# Altium schematic sheet EEG_Thesis.SchDoc
size 805 x 279 mm; SheetNumber: 1; SheetTotal: 1
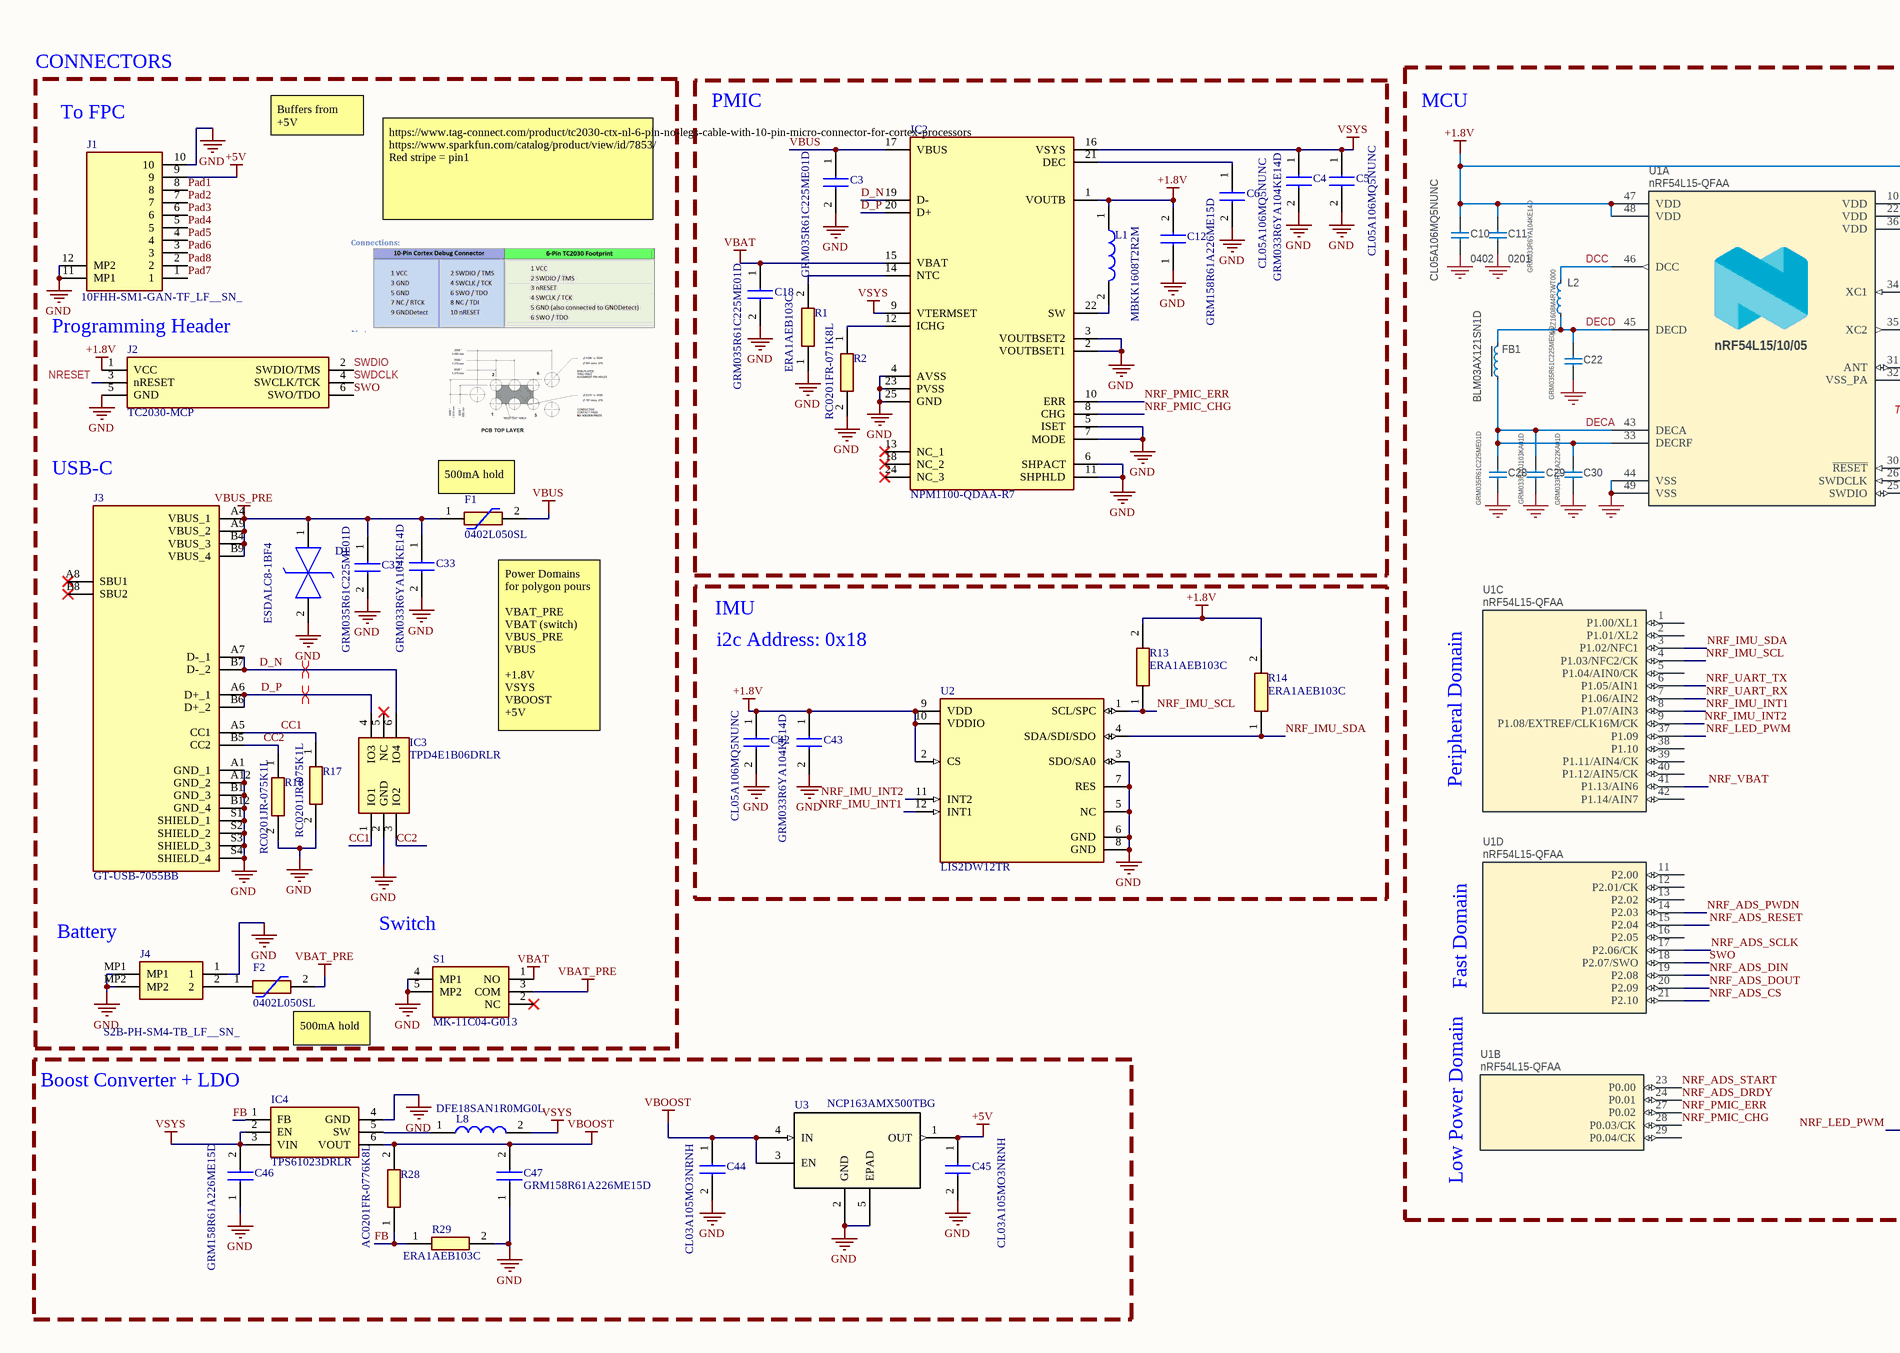
[diagram p0: EEG_Thesis.SchDoc, left]
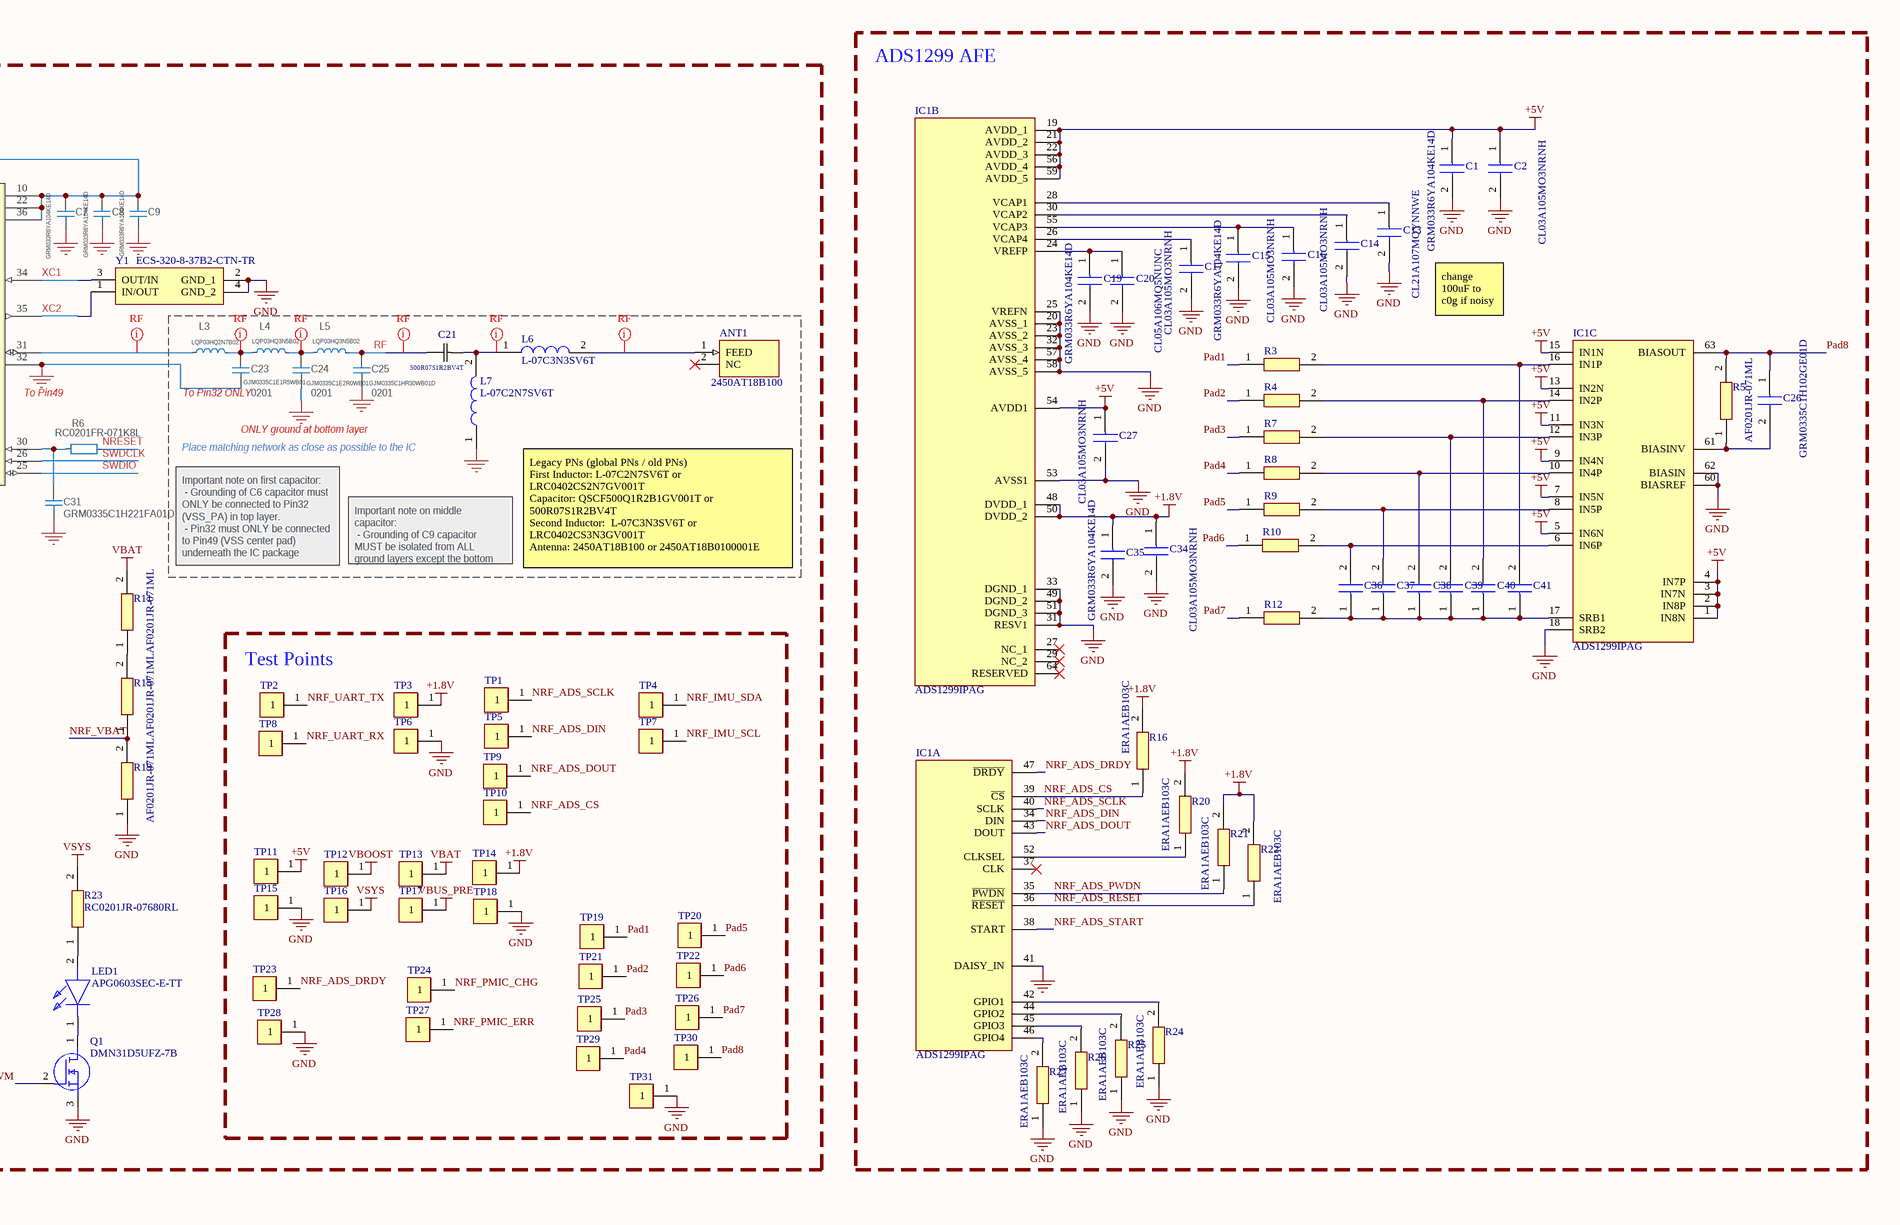
[diagram p1: EEG_Thesis.SchDoc, right]

## Parts
ANT1  2450AT18B100  [ANTC3216X140N]
C1  GRM033R6YA104KE14D  [CAPC0603X33N]
C2  CL03A105MO3NRNH  [CAPC0603X39N]
C3  GRM035R61C225ME01D  [GRM033D70J224ME01D]
C4  GRM033R6YA104KE14D  [CAPC0603X33N]
C5  CL05A106MQ5NUNC  [CAPC1005X70N]
C6  CL05A106MQ5NUNC  [CAPC1005X70N]
C7  GRM033R6YA104KE14D  [0201_GENERIC_CAP]
C8  GRM033R6YA104KE14D  [0201_GENERIC_CAP]
C9  GRM033R6YA104KE14D  [0201_GENERIC_CAP]
C10  CL05A106MQ5NUNC  Footprint Doc: 0402  [0402_Generic_CAP]
C11  GRM033R6YA104KE14D  Footprint Doc: 0201  [0201_GENERIC_CAP]
C12  GRM158R61A226ME15D  [GRM15x]
C13  CL21A107MQYNNWE  [CAPC2012X145N]
C14  CL03A105MO3NRNH  [CAPC0603X39N]
C15  GRM033R6YA104KE14D  [CAPC0603X33N]
C16  CL03A105MO3NRNH  [CAPC0603X39N]
C17  CL03A105MO3NRNH  [CAPC0603X39N]
C18  GRM035R61C225ME01D  [GRM033D70J224ME01D]
C19  GRM033R6YA104KE14D  [CAPC0603X33N]
C20  CL05A106MQ5NUNC  [CAPC1005X70N]
C21  500R07S1R2BV4T  [CAP_500R07S1R2BV4T_JOT]
C22  GRM035R61C225ME01D  [0201_GENERIC_CAP]
C23  GJM0335C1E1R5WB01  Footprint Doc: 0201  [0201_GENERIC_CAP]
C24  GJM0335C1E2R0WB01  Footprint Doc: 0201  [0201_GENERIC_CAP]
C25  GJM0335C1HR30WB01D  Footprint Doc: 0201  [0201_GENERIC_CAP]
C26  GRM0335C1H102GE01D  [GRM033D70J224ME01D]
C27  CL03A105MO3NRNH  [CAPC0603X39N]
C28  GRM035R61C225ME01D  [0201_GENERIC_CAP]
C29  GRM033R70J103KA01D  [0201_GENERIC_CAP]
C30  GRM033R71A222KA01D  [0201_GENERIC_CAP]
C31  GRM0335C1H221FA01D  [0201_GENERIC_CAP]
C32  GRM035R61C225ME01D  [GRM033D70J224ME01D]
C33  GRM033R6YA104KE14D  [CAPC0603X33N]
C34  CL03A105MO3NRNH  [CAPC0603X39N]
C35  GRM033R6YA104KE14D  [CAPC0603X33N]
C36  GRM0335C1H221FA01D  [GRM033D70J224ME01D]  (value not drawn)
C37  GRM0335C1H221FA01D  [GRM033D70J224ME01D]  (value not drawn)
C38  GRM0335C1H221FA01D  [GRM033D70J224ME01D]  (value not drawn)
C39  GRM0335C1H221FA01D  [GRM033D70J224ME01D]  (value not drawn)
C40  GRM0335C1H221FA01D  [GRM033D70J224ME01D]  (value not drawn)
C41  GRM0335C1H221FA01D  [GRM033D70J224ME01D]  (value not drawn)
C42  CL05A106MQ5NUNC  [CAPC1005X70N]
C43  GRM033R6YA104KE14D  [CAPC0603X33N]
C44  CL03A105MO3NRNH  [CAPC0603X39N]
C45  CL03A105MO3NRNH  [CAPC0603X39N]
C46  GRM158R61A226ME15D  [GRM15x]
C47  GRM158R61A226ME15D  [GRM15x]
D1  ESDALC8-1BF4  [ESDALC81BF4]
F1  0402L050SL  [0402L010SLKR]
F2  0402L050SL  [0402L010SLKR]
FB1  BLM03AX121SN1D  [BLM03AX121SN1D]
IC1  ADS1299IPAG  [QFP50P1200X1200X120-64N]  (parts A,B,C of 3)
IC2  NPM1100-QDAA-R7  [QFN50P400X400X90-25N-D]
IC3  TPD4E1B06DRLR  [SOTFL50P160X60-6N]
IC4  TPS61023DRLR  [SOTFL50P160X60-6N]
J1  10FHH-SM1-GAN-TF_LF__SN_  [10FHHSM1GANTFLFSN]
J2  TC2030-MCP  [TC2030MCP]
J3  GT-USB-7055BB  [GTUSB7055BB]
J4  S2B-PH-SM4-TB_LF__SN_  [S2BPHSM4TBLFSN]
L1  MBKK1608T2R2M  [MBKK1608T1R0M]
L2  MLZ1608M4R7WT000  [MLZ1608M4R7WT000]
L3  LQP03HQ2N7B02  [LQP03HQ2N7B02]
L4  LQP03HQ3N5B02  [LQP03HQ2N7B02]
L5  LQP03HQ3N5B02  [LQP03HQ2N7B02]
L6  L-07C3N3SV6T  [INDC1005X60N]
L7  L-07C2N7SV6T  [INDC1005X60N]
L8  DFE18SAN1R0MG0L  [INDC1608X100N]
LED1  APG0603SEC-E-TT  [APG0603SECETT]
Q1  DMN31D5UFZ-7B  [X2-DFN0606-3]
R1  ERA1AEB103C  [ERA1A_(0201)]
R2  RC0201FR-071K8L  [RESC0603X26N]
R3  ERA1AEB103C  [ERA1A_(0201)]  (value not drawn)
R4  ERA1AEB103C  [ERA1A_(0201)]  (value not drawn)
R5  AF0201JR-071ML  [ERA1A_(0201)]
R6  RC0201FR-071K8L  [0201_GENERIC_RES]
R7  ERA1AEB103C  [ERA1A_(0201)]  (value not drawn)
R8  ERA1AEB103C  [ERA1A_(0201)]  (value not drawn)
R9  ERA1AEB103C  [ERA1A_(0201)]  (value not drawn)
R10  ERA1AEB103C  [ERA1A_(0201)]  (value not drawn)
R11  AF0201JR-071ML  [ERA1A_(0201)]
R12  ERA1AEB103C  [ERA1A_(0201)]  (value not drawn)
R13  ERA1AEB103C  [ERA1A_(0201)]
R14  ERA1AEB103C  [ERA1A_(0201)]
R15  AF0201JR-071ML  [ERA1A_(0201)]
R16  ERA1AEB103C  [ERA1A_(0201)]
R17  RC0201JR-075K1L  [RESC0603X26N]
R18  RC0201JR-075K1L  [RESC0603X26N]
R19  AF0201JR-071ML  [ERA1A_(0201)]
R20  ERA1AEB103C  [ERA1A_(0201)]
R21  ERA1AEB103C  [ERA1A_(0201)]
R22  ERA1AEB103C  [ERA1A_(0201)]
R23  RC0201JR-07680RL  [RESC0603X26N]
R24  ERA1AEB103C  [ERA1A_(0201)]
R25  ERA1AEB103C  [ERA1A_(0201)]
R26  ERA1AEB103C  [ERA1A_(0201)]
R27  ERA1AEB103C  [ERA1A_(0201)]
R28  AC0201FR-0776K8L  [RESC0603X26N]
R29  ERA1AEB103C  [ERA1A_(0201)]
S1  MK-11C04-G013  [MK11C04G013]
TP1  TP  [TP]  (value not drawn)
TP2  TP  [TP]  (value not drawn)
TP3  TP  [TP]  (value not drawn)
TP4  TP  [TP]  (value not drawn)
TP5  TP  [TP]  (value not drawn)
TP6  TP  [TP]  (value not drawn)
TP7  TP  [TP]  (value not drawn)
TP8  TP  [TP]  (value not drawn)
TP9  TP  [TP]  (value not drawn)
TP10  TP  [TP]  (value not drawn)
TP11  TP  [TP]  (value not drawn)
TP12  TP  [TP]  (value not drawn)
TP13  TP  [TP]  (value not drawn)
TP14  TP  [TP]  (value not drawn)
TP15  TP  [TP]  (value not drawn)
TP16  TP  [TP]  (value not drawn)
TP17  TP  [TP]  (value not drawn)
TP18  TP  [TP]  (value not drawn)
TP19  TP  [TP]  (value not drawn)
TP20  TP  [TP]  (value not drawn)
TP21  TP  [TP]  (value not drawn)
TP22  TP  [TP]  (value not drawn)
TP23  TP  [TP]  (value not drawn)
TP24  TP  [TP]  (value not drawn)
TP25  TP  [TP]  (value not drawn)
TP26  TP  [TP]  (value not drawn)
TP27  TP  [TP]  (value not drawn)
TP28  TP  [TP]  (value not drawn)
TP29  TP  [TP]  (value not drawn)
TP30  TP  [TP]  (value not drawn)
TP31  TP  [TP]  (value not drawn)
U1  nRF54L15-QFAA  [nRF54L15 CUSTOM]  (parts A,B,C,D of 4)
U2  LIS2DW12TR  [FP-LGA12-DM00170568-MFG]
U3  NCP163AMX500TBG  [XDFN4_711AJ_ONS]
Y1  ECS-320-8-37B2-CTN-TR  [ECS320837B2CTNTR]

## Blocks framed on the sheet
ADS1299 AFE: C1 C2 C13-C17 C19 C20 C26 C27 C34-C41 IC1 R3-R5 R7-R10 R12 R16 R20-R22 R24-R27
PMIC: C3-C6 C12 C18 IC2 L1 R1 R2
Test Points: TP1-TP31
Boost Converter + LDO: C44-C47 IC4 L8 R28 R29 U3

## Nets
+1.8V: C7.1 C8.1 C9.1 C10.2 C11.1 C12.2 C34.1 C35.1 C42.1 C43.1 IC1.48(DVDD_1) IC1.50(DVDD_2) IC2.1(VOUTB) J2.1(VCC) L1.1 R13.2 R14.2 R16.2 R20.2 R21.2 R22.2 TP3.1 TP14.1 U1.10(VDD) U1.22(VDD) U1.36(VDD) U1.47(VDD) U1.48(VDD) U2.2(CS) U2.9(VDD) U2.10(VDDIO)
+5V: C1.1 C2.1 C27.1 C45.1 IC1.1(IN8N) IC1.2(IN8P) IC1.3(IN7N) IC1.4(IN7P) IC1.5(IN6N) IC1.7(IN5N) IC1.9(IN4N) IC1.11(IN3N) IC1.13(IN2N) IC1.15(IN1N) IC1.19(AVDD_1) IC1.21(AVDD_2) IC1.22(AVDD_3) IC1.54(AVDD1) IC1.56(AVDD_4) IC1.59(AVDD_5) J1.9 TP11.1 U3.1(OUT)
GND: C1.2 C2.2 C3.2 C4.2 C5.2 C6.2 C7.2 C8.2 C9.2 C10.1 C11.2 C12.1 C13.2 C14.2 C15.2 C16.2 C17.2 C18.2 C19.2 C20.2 C22.1 C23.1 C24.1 C25.1 C27.2 C28.1 C29.1 C30.1 C31.1 C32.2 C33.2 C34.2 C35.2 C42.2 C43.2 C44.2 C45.2 C46.1 C47.1 D1.2(K2) IC1.18(SRB2) IC1.20(AVSS_1) IC1.23(AVSS_2) IC1.25(VREFN) IC1.31(RESV1) IC1.32(AVSS_3) IC1.33(DGND_1) IC1.41(DAISY_IN) IC1.49(DGND_2) IC1.51(DGND_3) IC1.53(AVSS1) IC1.57(AVSS_4) IC1.58(AVSS_5) IC1.60(BIASREF) IC1.62(BIASIN) IC2.2(VOUTBSET1) IC2.3(VOUTBSET2) IC2.4(AVSS) IC2.5(ISET) IC2.6(SHPACT) IC2.7(MODE) IC2.11(SHPHLD) IC2.23(PVSS) IC2.25(GND) IC3.2(GND) IC4.4(GND) J1.10 J1.11(MP1) J1.12(MP2) J2.5(GND) J3.A1(GND_1) J3.A12(GND_2) J3.B1(GND_3) J3.B12(GND_4) J3.S1(SHIELD_1) J3.S2(SHIELD_2) J3.S3(SHIELD_3) J3.S4(SHIELD_4) J4.1 J4.MP1 J4.MP2 L7.1 Q1.3(S) R1.1 R2.2 R17.2 R18.2 R19.1 R24.1 R25.1 R26.1 R27.1 R29.2 S1.4(MP1) S1.5(MP2) TP6.1 TP15.1 TP18.1 TP28.1 TP31.1 U1.32(VSS_PA) U1.44(VSS) U1.49(VSS) U2.3(SDO/SA0) U2.5(NC) U2.6(GND) U2.7(RES) U2.8(GND) U3.2(GND) U3.5(EPAD) Y1.2(GND_1) Y1.4(GND_2)
VBAT: C18.1 IC2.15(VBAT) R11.2 S1.1(NO) TP13.1
VBAT_PRE: F2.2 S1.3(COM)
VBOOST: C44.1 C47.2 IC4.6(VOUT) R28.2 TP12.1 U3.3(EN) U3.4(IN)
VBUS: C3.1 F1.2 IC2.17(VBUS)
VBUS_PRE: C32.1 C33.1 D1.1(K1) F1.1 J3.A4(VBUS_1) J3.A9(VBUS_2) J3.B4(VBUS_3) J3.B9(VBUS_4) TP17.1
VSYS: C4.1 C5.1 C46.2 IC2.9(VTERMSET) IC2.16(VSYS) IC4.2(EN) IC4.3(VIN) L8.2 R23.2 TP16.1
CC1: IC3.1(IO1) J3.A5(CC1) R17.1
CC2: IC3.3(IO2) J3.B5(CC2) R18.1
D_N: IC2.19(D-) IC3.6(IO4) J3.A7(D-_1) J3.B7(D-_2)
D_P: IC2.20(D+) IC3.4(IO3) J3.A6(D+_1) J3.B6(D+_2)
DCC: L2.1 U1.46(DCC)
DECA: C28.2 C29.2 C30.2 FB1.2 U1.33(DECRF) U1.43(DECA)
DECD: C22.2 FB1.1 L2.2 U1.45(DECD)
FB: IC4.1(FB) R28.1 R29.1
NRESET: J2.3(nRESET) R6.2
NRF_ADS_CS: IC1.39(~{CS}) R16.1 TP10.1 U1.21(P2.10)
NRF_ADS_DIN: IC1.34(DIN) TP5.1 U1.19(P2.08)
NRF_ADS_DOUT: IC1.43(DOUT) TP9.1 U1.20(P2.09)
NRF_ADS_DRDY: IC1.47(~{DRDY}) TP23.1 U1.24(P0.01)
NRF_ADS_PWDN: IC1.35(~{PWDN}) R21.1 U1.14(P2.03)
NRF_ADS_RESET: IC1.36(~{RESET}) R22.1 U1.15(P2.04)
NRF_ADS_SCLK: IC1.40(SCLK) TP1.1 U1.17(P2.06/CK)
NRF_ADS_START: IC1.38(START) U1.23(P0.00)
NRF_IMU_INT1: U1.8(P1.07/AIN3) U2.12(INT1)
NRF_IMU_INT2: U1.9(P1.08/EXTREF/CLK16M/CK) U2.11(INT2)
NRF_IMU_SCL: R13.1 TP7.1 U1.4(P1.03/NFC2/CK) U2.1(SCL/SPC)
NRF_IMU_SDA: R14.1 TP4.1 U1.3(P1.02/NFC1) U2.4(SDA/SDI/SDO)
NRF_LED_PWM: Q1.2(G) U1.37(P1.09)
NRF_PMIC_CHG: IC2.8(CHG) TP24.1 U1.28(P0.03/CK)
NRF_PMIC_ERR: IC2.10(ERR) TP27.1 U1.27(P0.02)
NRF_UART_RX: TP8.1 U1.7(P1.06/AIN2)
NRF_UART_TX: TP2.1 U1.6(P1.05/AIN1)
NRF_VBAT: R15.1 R19.2 U1.41(P1.13/AIN6)
Pad1: J1.8 R3.1 TP19.1
Pad2: J1.7 R4.1 TP21.1
Pad3: J1.6 R7.1 TP25.1
Pad4: J1.5 R8.1 TP29.1
Pad5: J1.4 R9.1 TP20.1
Pad6: J1.3 R10.1 TP22.1
Pad7: J1.1 R12.1 TP26.1
Pad8: C26.1 IC1.63(BIASOUT) J1.2 R5.2 TP30.1
RF: C21.2 C25.2 L5.2
SWDCLK: J2.4(SWCLK/TCK) U1.26(SWDCLK)
SWDIO: J2.2(SWDIO/TMS) U1.25(SWDIO)
SWO: J2.6(SWO/TDO) U1.18(P2.07/SWO)
XC1: U1.34(XC1) Y1.3(OUT/IN)
XC2: U1.35(XC2) Y1.1(IN/OUT)
NetANT1_1: ANT1.1(FEED) L6.2
NetC6_1: C6.1 IC2.21(DEC)
NetC13_1: C13.1 IC1.28(VCAP1)
NetC14_1: C14.1 IC1.30(VCAP2)
NetC15_1: C15.1 C16.1 IC1.55(VCAP3)
NetC17_1: C17.1 IC1.26(VCAP4)
NetC19_1: C19.1 C20.1 IC1.24(VREFP)
NetC21_1: C21.1 L6.1 L7.2
NetC23_2: C23.2 L3.2 L4.1
NetC24_2: C24.2 L4.2 L5.1
NetC26_2: C26.2 IC1.61(BIASINV) R5.1
NetC31_2: C31.2 R6.1 U1.30(~{RESET})
NetC36_1: C36.1 C37.1 C38.1 C39.1 C40.1 C41.1 IC1.17(SRB1) R12.2
NetC36_2: C36.2 IC1.6(IN6P) R10.2
NetC37_2: C37.2 IC1.8(IN5P) R9.2
NetC38_2: C38.2 IC1.10(IN4P) R8.2
NetC39_2: C39.2 IC1.12(IN3P) R7.2
NetC40_2: C40.2 IC1.14(IN2P) R4.2
NetC41_2: C41.2 IC1.16(IN1P) R3.2
NetF2_1: F2.1 J4.2
NetIC1_42: IC1.42(GPIO1) R24.2
NetIC1_44: IC1.44(GPIO2) R25.2
NetIC1_45: IC1.45(GPIO3) R26.2
NetIC1_46: IC1.46(GPIO4) R27.2
NetIC1_52: IC1.52(CLKSEL) R20.1
NetIC2_12: IC2.12(ICHG) R2.1
NetIC2_14: IC2.14(NTC) R1.2
NetIC2_22: IC2.22(SW) L1.2
NetIC4_5: IC4.5(SW) L8.1
NetL3_1: L3.1 U1.31(ANT)
NetLED1_1: LED1.1(K) Q1.1(D)
NetLED1_2: LED1.2(A) R23.1
NetR11_1: R11.1 R15.2

Not connected (* = marked no-connect by the designer): ANT1 2(NC)*; IC1 27(NC_1)* 29(NC_2)* 37(CLK)* 64(RESERVED)*; IC2 13(NC_1)* 18(NC_2)* 24(NC_3)*; IC3 5(NC)*; J3 A8(SBU1)* B8(SBU2)*; S1 2(NC)*; U1 1(P1.00/XL1) 2(P1.01/XL2) 5(P1.04/AIN0/CK) 11(P2.00) 12(P2.01/CK) 13(P2.02) 16(P2.05) 29(P0.04/CK) 38(P1.10) 39(P1.11/AIN4/CK) 40(P1.12/AIN5/CK) 42(P1.14/AIN7)

## Layout directives
differential pair; net class USB; differential pair class USB: D_N, D_P
net class RF: NetANT1_1, NetC21_1, NetC23_2, NetC24_2, NetL3_1, RF

## Notes on the sheet
- CONNECTORS
- (near J1) To FPC
- Buffers from +5V
- MCU
- https://www.tag-connect.com/product/tc2030-ctx-nl-6-pin-no-legs-cable-with-10-pin-micro-connector-for-cortex-processors https://www.sparkfun.com/catalog/product/view/id/7853/
  Red stripe = pin1
- change 100uF to c0g if noisy
- Programming Header
- (near U1) To Pin49
- (near C23) To Pin32 ONLY
- ONLY ground at bottom layer
- (near J3) USB-C
- (near F1) 500mA hold
- (near L7) Place matching network as close as possible to the IC
- IMU
- Important note on first capacitor:
  - Grounding of C6 capacitor must ONLY be connected to Pin32 (VSS_PA) in top layer.
  - Pin32 must ONLY be connected to Pin49 (VSS center pad) underneath the IC package
- Important note on middle capacitor:
  - Grounding of C9 capacitor MUST be isolated from ALL ground layers except the bottom ground layer.
- Legacy PNs (global PNs / old PNs)
  First Inductor: L-07C2N7SV6T or LRC0402CS2N7GV001T
  Capacitor: QSCF500Q1R2B1GV001T or 500R07S1R2BV4T
  Second Inductor:  L-07C3N3SV6T or LRC0402CS3N3GV001T
  Antenna: 2450AT18B100 or 2450AT18B0100001E
- i2c Address: 0x18
- (near F1) Power Domains
  for polygon pours
  VBAT_PRE
  VBAT (switch)
  VBUS_PRE
  VBUS
  +1.8V
  VSYS
  VBOOST
  +5V
- Peripheral Domain
- (near J4) Battery
- (near S1) Switch
- Fast Domain
- (near F2) 500mA hold
- Low Power Domain
- (in symbol nRF54L15-QFAAC00, part A) nRF54L15/10/05

## Library data of the parts
ANT1 = 2450AT18B0100001E: Antenna; Manufacturer_Name: JOHANSON TECHNOLOGY; Datasheet Link: https://www.johansontechnology.com/docs/3829/Antenna-2450AT18B0100001E-Rev5.0_uMmswfC.pdf; Height: 1.4mm; Manufacturer_Part_Number: 2450AT18B0100001E
C1 C4 C15 C19 C33 C35 C43 = GRM033R6YA104KE14D: Capacitor 0.1uF 0201; Manufacturer_Name: Murata Electronics; Datasheet Link: https://search.murata.co.jp/Ceramy/image/img/A01X/G101/ENG/GRM033R6YA104KE14-01A.pdf; Height: 0.33mm; Manufacturer_Part_Number: GRM033R6YA104KE14D; Mouser Part Number: 81-GRM33R6YA104KE14D; Mouser Price/Stock: https://www.mouser.co.uk/ProductDetail/Murata-Electronics/GRM033R6YA104KE14D?qs=P%2FC4Eoq9CDwTt3wOuyKhXw%3D%3D; Arrow Part Number: GRM033R6YA104KE14D; Arrow Price/Stock: https://www.arrow.com/en/products/grm033r6ya104ke14d/murata-manufacturing?utm_currency=USD&region=europe
C2 C14 C16 C17 C27 C34 C44 C45 = CL03A105MO3NRNH: Capacitor 1uF 0201; Manufacturer_Name: SAMSUNG; Datasheet Link: https://static6.arrow.com/aropdfconversion/5520c68c9128c972ec6f0cbf09912ac8e6a87451/cl03a105mo3nrnh.pdf; Height: 0.39mm; Manufacturer_Part_Number: CL03A105MO3NRNH; Mouser Part Number: 187-CL03A105MO3NRNH; Mouser Price/Stock: https://www.mouser.co.uk/ProductDetail/Samsung-Electro-Mechanics/CL03A105MO3NRNH?qs=%252B6g0mu59x7LEwOOdfYkIjw%3D%3D; Arrow Part Number: CL03A105MO3NRNH; Arrow Price/Stock: https://www.arrow.com/en/products/cl03a105mo3nrnh/samsung-electro-mechanics?region=europe
C3 C18 C32 = GRM035R61C225ME01D: Capacitor 2.2uF 0201; Manufacturer_Name: Murata Electronics; Datasheet Link: https://search.murata.co.jp/Ceramy/image/img/A01X/G101/ENG/GRM035R61C225ME01-01A.pdf; Height: 0.33mm; Manufacturer_Part_Number: GRM035R61C225ME01D; Mouser Part Number: 81-GRM035R61C225ME1D; Mouser Price/Stock: https://www.mouser.co.uk/ProductDetail/Murata-Electronics/GRM035R61C225ME01D?qs=DPoM0jnrROXTliYh3Jmu1A%3D%3D
C5 C6 C20 C42 = CL05A106MQ5NUNC: Capacitor 10uF 0402 6.3V; Manufacturer_Name: SAMSUNG; Datasheet Link: https://datasheet.datasheetarchive.com/originals/distributors/Datasheets-DGA10/2406160.pdf; Height: 0.7mm; Manufacturer_Part_Number: CL05A106MQ5NUNC; Mouser Part Number: 187-CL05A106MQ5NUNC; Mouser Price/Stock: https://www.mouser.co.uk/ProductDetail/Samsung-Electro-Mechanics/CL05A106MQ5NUNC?qs=X6jEic%2FHinDK8vVLi1zwpw%3D%3D; Arrow Part Number: CL05A106MQ5NUNC; Arrow Price/Stock: https://www.arrow.com/en/products/cl05a106mq5nunc/samsung-electro-mechanics.html?utm_currency=USD&region=europe
C7-C9 = C0201-100n-10V-X7R: Capacitor, X7R, ±10%; Manufacturer: N.A.; Part number NEMS: 100200469; Value: 100nF; Note: 10V; Pad Count: 2; Component Status: Active; Part Number: C0201-100n-10V-X7R; Manufacturer Part Number: N.A.; LatestRevisionDate: 2021-04-12; Published: 2021-04-12; Artikkelnr Noca: N.A.; Part number IPS: N.A.; ComponentLink1URL: N.A.; ComponentLink1Description: Datasheet; ComponentLink2URL: N.A.; ComponentLink2Description: Supplier link; HelpURL: N.A.; Supplier 1: N.A.; Supplier Part Number 1: N.A.; Supplier 2: N.A.; Supplier Part Number 2: N.A.; Component Class: Capacitors; Author: getr; Part number Norautron: N.A.; PartId: 100200469
C10 = C0402-10µF-6.3V-X6S: Capacitor 10uF 0402 6.3V; Manufacturer: N.A.; Part number NEMS: 100200478; Component Status: Active; Pad Count: 2; Value: 10µF; Part Number: C0402-10µF-6.3V-X6S; PartId: 100200478; Component Class: Capacitors; Author: getr; Manufacturer Part Number: N.A.; ComponentLink1URL: N.A.; ComponentLink1Description: Datasheet; ComponentLink2URL: N.A.; ComponentLink2Description: Supplier link; HelpURL: N.A.; LatestRevisionDate: 2021-06-25; Published: 2021-06-25; Note: 6.3V; Supplier 1: N.A.; Supplier Part Number 1: N.A.; Supplier 2: N.A.; Supplier Part Number 2: N.A.; Artikkelnr Noca: N.A.; Part number IPS: N.A.; Part number Norautron: N.A.
C11 = C0201-100n-10V-X7R: Capacitor, X7R, ±10% 0201; Manufacturer: N.A.; Part number NEMS: 100200469; Value: 100nF; Note: 10V; Pad Count: 2; Component Status: Active; Part Number: C0201-100n-10V-X7R; Manufacturer Part Number: N.A.; LatestRevisionDate: 2021-04-12; Published: 2021-04-12; Artikkelnr Noca: N.A.; Part number IPS: N.A.; ComponentLink1URL: N.A.; ComponentLink1Description: Datasheet; ComponentLink2URL: N.A.; ComponentLink2Description: Supplier link; HelpURL: N.A.; Supplier 1: N.A.; Supplier Part Number 1: N.A.; Supplier 2: N.A.; Supplier Part Number 2: N.A.; Component Class: Capacitors; Author: getr; Part number Norautron: N.A.; PartId: 100200469
C12 C46 C47 = GRM158R61A226ME15D: Capacitor 22uF 0402; Manufacturer_Name: Murata Electronics; Datasheet Link: https://search.murata.co.jp/Ceramy/image/img/A01X/G101/ENG/GRM158R61A226ME15-01A.pdf; Height: 0.33mm; Manufacturer_Part_Number: GRM158R61A226ME15D; Mouser Part Number: 81-GRM158R61A226ME5D; Mouser Price/Stock: https://www.mouser.co.uk/ProductDetail/Murata-Electronics/GRM158R61A226ME15D?qs=hd1VzrDQEGg0KAVI30ga2w%3D%3D; Arrow Part Number: GRM158R61A226ME15D; Arrow Price/Stock: https://www.arrow.com/en/products/grm158r61a226me15d/murata-manufacturing?utm_currency=USD&region=nac
C13 = CL21A107MQYNNWE: Capacitor 100uF; Manufacturer_Name: SAMSUNG; Datasheet Link: https://www.mouser.jp/datasheet/2/585/Samsung_7_14_2022_CL21A107MQYNNW_Specsheet-3000071.pdf; Height: 1.45mm; Manufacturer_Part_Number: CL21A107MQYNNWE; Mouser Part Number: 187-CL21A107MQYNNWE; Mouser Price/Stock: https://www.mouser.co.uk/ProductDetail/Samsung-Electro-Mechanics/CL21A107MQYNNWE?qs=81r%252BiQLm7BSNi6fWCnDBNQ%3D%3D; Arrow Part Number: CL21A107MQYNNWE; Arrow Price/Stock: https://www.arrow.com/en/products/cl21a107mqynnwe/samsung-electro-mechanics?utm_currency=USD&region=nac
C21 = 500R07S1R2BV4T: Description; Manufacturer_Name: Johanson Technology; Copyright: Copyright (C) 2025 Ultra Librarian. All rights reserved.; Manufacturer_Part_Number: 500R07S1R2BV4T
C22 C28 = C0201-2µ2-2.5V-X6T-GRM033D80E225ME47D: Capacitor, Ceramic, 2.2µF 2.5V X6T 0201,±20%; Manufacturer: Murata; Manufacturer Part Number: GRM033R61A225KE47; Part number NEMS: 100200527; Component Status: Active; Pad Count: 2; Note: 2.5V, 20%, X6T; Artikkelnr Noca: N.A.; Part Number: C0201-2µ2-2.5V-X6T-GRM033D80E225ME47D; Component Class: Capacitors; Author: stl1; ComponentLink1URL: https://www.murata.com/products/productdetail?partno=GRM033D80E225ME47%23; ComponentLink1Description: Datasheet; ComponentLink2URL: N.A.; ComponentLink2Description: Supplier link; HelpURL: N.A.; LatestRevisionDate: 2022-02-27; Published: 2022-02-27; Value: 2.2µF; Supplier 1: Mouser; Supplier Part Number 1: 81-GRM033D80E225ME7D; Supplier 2: Digi-Key; Supplier Part Number 2: 490-18653-1-ND; Part number IPS: N.A.; Part number Norautron: N.A.; PartId: 100200527
C23 = C0201-1.5p-25V-NP0-GJM0335C1E1R5WB01: Capacitor, 1.5pF, NP0, ±0.05pF, 25V, High Q; Manufacturer: Murata; Part number NEMS: 100200477; Component Status: Active; Pad Count: 2; Artikkelnr Noca: N.A.; Part Number: C0201-1.5p-25V-NP0-GJM0335C1E1R5WB01; PartId: 100200477; Component Class: Capacitors; Author: masi; Manufacturer Part Number: GJM0335C1E1R5WB01; ComponentLink1URL: https://search.murata.co.jp/Ceramy/image/img/A01X/G101/ENG/GJM0335C1E1R5WB01-01.pdf; ComponentLink1Description: Datasheet; ComponentLink2URL: N.A.; ComponentLink2Description: Supplier link; HelpURL: https://www.murata.com/products/productdetail?partno=GJM0335C1E1R5WB01%23; LatestRevisionDate: 2021-06-15; Published: 2021-06-15; Value: 1.5pF; Note: 25V; Supplier 1: Digi-Key; Supplier Part Number 1: 490-11176-2-ND; Supplier 2: Mouser; Supplier Part Number 2: 81-GJM0335C1E1R5WB1D; Part number IPS: N.A.; Part number Norautron: N.A.
C24 = C0201-2.0p-HQ-Murata: Capacitor, 2pF, NP0, ±0.05pF, 25V; Manufacturer: Murata; Part number IPS: 00000001775; Part number NEMS: 100200419; Component Status: Active; Pad Count: 2; Value: 2.0pF; Artikkelnr Noca: N.A.; Part Number: C0201-2.0p-HQ-Murata; PartId: 100200419; Component Class: Capacitors; Author: rsk; Manufacturer Part Number: GJM0335C1E2R0WB01; ComponentLink1URL: N.A.; ComponentLink1Description: Datasheet; ComponentLink2URL: N.A.; ComponentLink2Description: Supplier link; HelpURL: https://psearch.en.murata.com/capacitor/product/GJM0335C1E2R0WB01%23.html; LatestRevisionDate: 2018-10-25; Published: 2018-10-25; Note: 25V; Supplier 1: N.A.; Supplier Part Number 1: N.A.; Supplier 2: N.A.; Supplier Part Number 2: N.A.; Part number Norautron: N.A.
C25 = C0201-0.3p-50V-GRM0335C1HR30BA01: Capacitor, C0G, ±0.1pF, 50V; Manufacturer: Murata; Part number NEMS: 100200650; Component Status: Active; Pad Count: 2; Value: 0.3pF; Artikkelnr Noca: N.A.; Part Number: C0201-0.3p-50V-GRM0335C1HR30BA01; PartId: 100200650; Component Class: Capacitors; Author: masi; Manufacturer Part Number: GRM0335C1HR30BA01; ComponentLink1URL: https://www.murata.com/en-global/products/productdetail?partno=GRM0335C1HR30BA01%23; ComponentLink1Description: Datasheet; ComponentLink2URL: N.A.; ComponentLink2Description: Supplier link; HelpURL: N.A.; LatestRevisionDate: 2024-01-10; Published: 2024-01-10; Note: 50V; Supplier 1: Digi-Key; Supplier Part Number 1: 490-6135-2-ND; Supplier 2: Mouser; Supplier Part Number 2: 81-GRM0335C1HR30BA1D; Part number IPS: N.A.; Part number Norautron: N.A.
C26 = GRM0335C1H102GE01D: Capacitor 1nF; Manufacturer_Name: Murata Electronics; Datasheet Link: https://search.murata.co.jp/Ceramy/image/img/A01X/G101/ENG/GRM0335C1H102GE01-01A.pdf; Height: 0.33mm; Manufacturer_Part_Number: GRM0335C1H102GE01D; Mouser Part Number: 81-GRM0335C1H102GE1D; Mouser Price/Stock: https://www.mouser.co.uk/ProductDetail/Murata-Electronics/GRM0335C1H102GE01D?qs=DPoM0jnrROXb%252BXi%252BdiEYKA%3D%3D
C29 = C0201-10n-6.3V-X7R: Capacitor, 10nF; Manufacturer: Murata; Part number NEMS: 100200407; Component Status: Active; Pad Count: 2; Note: 6.3V; Artikkelnr Noca: N.A.; Part Number: C0201-10n-6.3V-X7R; PartId: 100200407; Component Class: Capacitors; Author: rsk; Manufacturer Part Number: GRM033R70J103KA01D; ComponentLink1URL: http://search.murata.co.jp/Ceramy/image/img/A01X/G101/ENG/GRM033R70J103KA01-01.pdf; ComponentLink1Description: Datasheet; ComponentLink2URL: N.A.; ComponentLink2Description: Supplier link; HelpURL: N.A.; LatestRevisionDate: 2020-10-13; Published: 2018-05-07; Value: 10nF; Supplier 1: Digi-Key; Supplier Part Number 1: 490-1262-1-ND; Supplier 2: N.A.; Supplier Part Number 2: N.A.; Part number IPS: N.A.; Part number Norautron: N.A.
C30 = C0201-2n2: Capacitor, X7R, ±10%, 10V 2.2nF; Manufacturer: N.A.; Part number IPS: 00000001778; Part number Norautron: 26470002; Part number NEMS: 100200060; Component Status: Active; Pad Count: 2; Part Number: C0201-2n2; PartId: 100200060; Component Class: Capacitors; Author: rsk; Manufacturer Part Number: N.A.; ComponentLink1URL: N.A.; ComponentLink1Description: Datasheet; ComponentLink2URL: N.A.; ComponentLink2Description: Supplier link; HelpURL: N.A.; LatestRevisionDate: 2014-11-13; Published: 2014-11-13; Value: 2.2nF; Note: 10V; Supplier 1: N.A.; Supplier Part Number 1: N.A.; Supplier 2: N.A.; Supplier Part Number 2: N.A.; Artikkelnr Noca: N.A.
C31 = C0201-3.9p: Chip Cap 0201; Manufacturer: N.A.; Part number NEMS: 100200024; Component Status: Active; Pad Count: 2; Value: 3.9pF; Note: Chip Cap 1%; Part Number: C0201-3.9p; PartId: 100200024; Component Class: Capacitors; Author: rsk; Manufacturer Part Number: N.A.; ComponentLink1URL: N.A.; ComponentLink1Description: Datasheet; ComponentLink2URL: N.A.; ComponentLink2Description: Supplier link; HelpURL: N.A.; LatestRevisionDate: 2014-11-13; Published: 2014-11-13; Supplier 1: N.A.; Supplier Part Number 1: N.A.; Supplier 2: N.A.; Supplier Part Number 2: N.A.; Artikkelnr Noca: N.A.; Part number IPS: N.A.; Part number Norautron: N.A.
C36-C41 = GRM0335C1H221FA01D: Capacitor 220pF; Manufacturer_Name: Murata Electronics; Datasheet Link: https://search.murata.co.jp/Ceramy/image/img/A01X/G101/ENG/GRM0335C1H221FA01-01A.pdf; Height: 0.33mm; Manufacturer_Part_Number: GRM0335C1H221FA01D; Mouser Part Number: 81-GRM0335C1H221FA1D; Mouser Price/Stock: https://www.mouser.co.uk/ProductDetail/Murata-Electronics/GRM0335C1H221FA01D/?qs=rrS6PyfT74d6B87t4Yhwdg%3D%3D
D1 = ESDALC8-1BF4: Diode ESD (Bi-directional); Manufacturer_Name: STMicroelectronics; Datasheet Link: https://www.st.com/resource/en/datasheet/esdalc8-1bf4.pdf; Height: 0.32mm; Manufacturer_Part_Number: ESDALC8-1BF4; Mouser Part Number: 511-ESDALC8-1BF4; Mouser Price/Stock: https://www.mouser.com/Search/Refine.aspx?Keyword=511-ESDALC8-1BF4; Arrow Part Number: ESDALC8-1BF4; Arrow Price/Stock: https://www.arrow.com/en/products/esdalc8-1bf4/stmicroelectronics
F1 F2 = 0402L050SL: Resettable Fuse; Manufacturer_Name: LITTELFUSE; Datasheet Link: https://g.componentsearchengine.com/Datasheets/1/0402L010SLKR.pdf; Height: 0.6mm; Manufacturer_Part_Number: 0402L050SL
FB1 = FB0201-120R@100M-200mA-BLM03AG121SN1D: Ferrite Bead, 120 Ohm @ 100MHz, 200mA, 500 mOhm Max; Manufacturer: Murata; Part number NEMS: 100300419; Component Status: Active; Pad Count: 2; Value: 120R/0.2A; Artikkelnr Noca: N.A.; Part Number: FB0201-120R@100M-200mA-BLM03AG121SN1D; Component Class: Inductors; Author: stl1; Manufacturer Part Number: BLM03AG121SN1D; ComponentLink1URL: https://www.murata.com/en-eu/products/productdetail?partno=BLM03AG121SN1%23; ComponentLink1Description: Datasheet; ComponentLink2URL: N.A.; ComponentLink2Description: Supplier link; HelpURL: N.A.; LatestRevisionDate: 2022-02-27; Published: 2022-02-27; Note: Ferrite Bead; Supplier 1: Digi-Key; Supplier Part Number 1: 490-5622-1-ND; Supplier 2: Mouser; Supplier Part Number 2: 81-BLM03AX121SN1D; Part number IPS: N.A.; Part number Norautron: N.A.; PartId: 100300419
IC1 = ADS1299IPAG: Integrated Circuit; Manufacturer_Name: Texas Instruments; Datasheet Link: http://www.ti.com/general/docs/lit/getliterature.tsp?genericPartNumber=ADS1299&&fileType=pdf; Height: 1.2mm; Manufacturer_Part_Number: ADS1299IPAG; Mouser Part Number: 595-ADS1299IPAG; Mouser Price/Stock: https://www.mouser.co.uk/ProductDetail/Texas-Instruments/ADS1299IPAG?qs=g9Q%2FF7kJgMyNB%2Fl7Pgr%252B%252BA%3D%3D; Arrow Part Number: ADS1299IPAG; Arrow Price/Stock: https://www.arrow.com/en/products/ads1299ipag/texas-instruments?utm_currency=USD&region=nac
IC2 = NPM1100-QDAA-R7: Integrated Circuit; Manufacturer_Name: Nordic Semiconductor; Datasheet Link: https://www.digikey.co.za/en/products/detail/nordic-semiconductor-asa/NPM1100-QDAA-R7/18069439?s=N4IgTCBcDaIHIAUCyBGFAGdBaAigEQEECsAlAdhAF0BfIA; Height: 0.9mm; Manufacturer_Part_Number: NPM1100-QDAA-R7; Mouser Part Number: 949-NPM1100-QDAA-R7; Mouser Price/Stock: https://www.mouser.co.uk/ProductDetail/Nordic-Semiconductor/NPM1100-QDAA-R7?qs=amGC7iS6iy8FBZdylLqz2Q%3D%3D; Arrow Part Number: NPM1100-QDAA-R7; Arrow Price/Stock: https://www.arrow.com/en/products/npm1100-qdaa-r7/nordic-semiconductor?utm_currency=USD&region=nac
IC3 = TPD4E1B06DRLR: Integrated Circuit; Manufacturer_Name: Texas Instruments; Datasheet Link: http://www.ti.com/lit/ds/symlink/tpd4e1b06.pdf; Height: 0.6mm; Manufacturer_Part_Number: TPD4E1B06DRLR; Mouser Part Number: 595-TPD4E1B06DRLR; Mouser Price/Stock: https://www.mouser.co.uk/ProductDetail/Texas-Instruments/TPD4E1B06DRLR?qs=1MXlzafEN387aRSX0e2MEQ%3D%3D; Arrow Part Number: TPD4E1B06DRLR; Arrow Price/Stock: https://www.arrow.com/en/products/tpd4e1b06drlr/texas-instruments?utm_currency=USD&region=nac
IC4 = TPS61023DRLR: Integrated Circuit; Manufacturer_Name: Texas Instruments; Datasheet Link: http://www.ti.com/lit/ds/symlink/tps61023.pdf; Height: 0.6mm; Manufacturer_Part_Number: TPS61023DRLR; Mouser Part Number: 595-TPS61023DRLR; Mouser Price/Stock: https://www.mouser.co.uk/ProductDetail/Texas-Instruments/TPS61023DRLR?qs=BJlw7L4Cy7%2FfEnwYuWeGOg%3D%3D; Arrow Part Number: TPS61023DRLR; Arrow Price/Stock: https://www.arrow.com/en/products/tps61023drlr/texas-instruments?utm_currency=USD&region=nac
J1 = 10FHH-SM1-GAN-TF_LF__SN_: Connector; Manufacturer_Name: JST (JAPAN SOLDERLESS TERMINALS); Manufacturer_Part_Number: 10FHH-SM1-GAN-TF(LF)(SN); Datasheet Link: https://www.jst.com/wp-content/uploads/2021/03/eFHH.pdf; Height: 2mm
J2 = TC2030-MCP: Connector; Manufacturer_Name: Tag Connect; Datasheet Link: https://datasheet.datasheetarchive.com/originals/distributors/Datasheets_SAMA/eee374929cd7518d6d3464b8148cd1bf.pdf; Height: 18.669mm; Manufacturer_Part_Number: TC2030-MCP
J3 = GT-USB-7055BB: Connector; Manufacturer_Name: G-Switch Electronic; Datasheet Link: https://www.dg-switch.com/uploads/soft/231230/GT-USB-7055BB.pdf; Height: 6.6mm; Manufacturer_Part_Number: GT-USB-7055BB
J4 = S2B-PH-SM4-TB_LF__SN_: Connector; Manufacturer_Name: JST (JAPAN SOLDERLESS TERMINALS); Manufacturer_Part_Number: S2B-PH-SM4-TB(LF)(SN); Datasheet Link: https://www.jst-mfg.com/product/pdf/eng/ePH.pdf; Height: 6.6mm; Mouser Part Number: N/A; Mouser Price/Stock: https://www.mouser.co.uk/ProductDetail/JST-Commercial/S2B-PH-SM4-TBLFSN?qs=QpmGXVUTftEA9IU90i0xlg%3D%3D; Arrow Part Number: S2B-PH-SM4-TB(LF)(SN); Arrow Price/Stock: https://www.arrow.com/en/products/s2b-ph-sm4-tb-lf-sn/jst-manufacturing?utm_currency=USD&region=europe
L1 = MBKK1608T2R2M: Inductor; Manufacturer_Name: TAIYO YUDEN; Datasheet Link: https://ds.yuden.co.jp/TYCOMPAS/ut/detail?pn=MBKK1608T2R2M%20%20&u=M; Height: 1mm; Manufacturer_Part_Number: MBKK1608T2R2M; Mouser Part Number: 963-MBKK1608T2R2M; Mouser Price/Stock: https://www.mouser.co.uk/ProductDetail/TAIYO-YUDEN/MBKK1608T2R2M?qs=DdDyqbI1VsjL85dwAH0aww%3D%3D; Arrow Part Number: MBKK1608T2R2M; Arrow Price/Stock: https://www.arrow.com/en/products/mbkk1608t2r2m/taiyo-yuden?region=nac
L2 = L0603-4µ7-MLZ1608M4R7WT000: Inductor, 120mA, ±20%, 0.65R; Manufacturer: TDK Corporation; Part number NEMS: 100300440; Component Status: Active; Pad Count: 2; Value: 4.7µH; Note: Power Inductor ±20%; Artikkelnr Noca: N.A.; Part Number: L0603-4µ7-MLZ1608M4R7WT000; PartId: 100300440; Component Class: Inductors; Author: stl1; Manufacturer Part Number: MLZ1608M4R7WT000; ComponentLink1URL: https://product.tdk.com/en/search/inductor/inductor/smd/info?part_no=MLZ1608M4R7WT000; ComponentLink1Description: Datasheet; ComponentLink2URL: N.A.; ComponentLink2Description: Supplier link; HelpURL: N.A.; LatestRevisionDate: 2023-05-10; Published: 2023-05-10; Supplier 1: Digi-Key; Supplier Part Number 1: 445-6390-2-ND; Supplier 2: Mouser; Supplier Part Number 2: 810-MLZ1608M4R7WT000; Part number IPS: N.A.; Part number Norautron: N.A.
L3 = L0201-2n7-HQ-Murata: Inductor, 2.7nH, 600mA, ±0.1ｎH, 120mOhm; Manufacturer: Murata; Part number IPS: 00000001753; Part number NEMS: 100300214; Component Status: Active; Pad Count: 2; Note: -55°C ~ 125°C; Artikkelnr Noca: N.A.; Part Number: L0201-2n7-HQ-Murata; PartId: 100300214; Component Class: Inductors; Author: rsk; Manufacturer Part Number: LQP03HQ2N7B02; ComponentLink1URL: https://search.murata.co.jp/Ceramy/image/img/P02/JELF243C-0021.pdf; ComponentLink1Description: Datasheet; ComponentLink2URL: N.A.; ComponentLink2Description: Supplier link; HelpURL: https://psearch.en.murata.com/inductor/product/LQP03HQ2N7B02%23.html; LatestRevisionDate: 2018-10-23; Published: 2018-10-23; Value: 2.7nH; Supplier 1: Digi-Key; Supplier Part Number 1: 490-13909-1-ND; Supplier 2: N.A.; Supplier Part Number 2: N.A.; Part number Norautron: N.A.
L4 L5 = L0201-3n5-HQ-Murata: Inductor, 3.5nH, 500mA, ±0.1ｎH, 170mOhm; Manufacturer: Murata; Part number NEMS: 100300222; Component Status: Active; Pad Count: 2; Note: -55°C ~ 125°C; Artikkelnr Noca: N.A.; Part Number: L0201-3n5-HQ-Murata; PartId: 100300222; Component Class: Inductors; Author: rsk; Manufacturer Part Number: LQP03HQ3N5B02; ComponentLink1URL: https://search.murata.co.jp/Ceramy/image/img/P02/JELF243C-0021.pdf; ComponentLink1Description: Datasheet; ComponentLink2URL: N.A.; ComponentLink2Description: Supplier link; HelpURL: https://psearch.en.murata.com/inductor/product/LQP03HQ3N5B02%23.html; LatestRevisionDate: 2018-10-23; Published: 2018-10-23; Value: 3.5nH; Supplier 1: Digi-Key; Supplier Part Number 1: 490-13925-1-ND; Supplier 2: N.A.; Supplier Part Number 2: N.A.; Part number IPS: N.A.; Part number Norautron: N.A.
L6 L7 = LRC0402CS3N3GV001T: Inductor; Manufacturer_Name: JOHANSON TECHNOLOGY; Datasheet Link: https://www.johansontechnology.com/docs/4510/ceramic-inductors-datasheet.pdf; Height: 0.6mm; Manufacturer_Part_Number: LRC0402CS3N3GV001T
L8 = DFE18SAN1R0MG0L: Inductor; Manufacturer_Name: Murata Electronics; Datasheet Link: https://search.murata.co.jp/Ceramy/image/img/P02/JETE243A-0036.pdf; Height: 1mm; Manufacturer_Part_Number: DFE18SAN1R0MG0L; Mouser Part Number: 81-DFE18SAN1R0MG0L; Mouser Price/Stock: https://www.mouser.co.uk/ProductDetail/Murata-Electronics/DFE18SAN1R0MG0L?qs=EU6FO9ffTwdBzqsLsYlEDA%3D%3D; Arrow Part Number: DFE18SAN1R0MG0L; Arrow Price/Stock: https://www.arrow.com/en/products/dfe18san1r0mg0l/murata-manufacturing?region=nac
LED1 = APG0603SEC-E-TT: LED; Manufacturer_Name: Kingbright; Datasheet Link: https://www.digikey.ph/en/products/detail/kingbright/APG0603SEC-E-TT/6072767; Height: 0.2mm; Manufacturer_Part_Number: APG0603SEC-E-TT; Mouser Part Number: 604-APG0603SECETT; Mouser Price/Stock: https://www.mouser.co.uk/ProductDetail/Kingbright/APG0603SEC-E-TT?qs=cRhdKgsiOJrYr%252BYSvKe71Q%3D%3D; Arrow Part Number: APG0603SEC-E-TT; Arrow Price/Stock: https://www.arrow.com/en/products/apg0603sec-e-tt/kingbright?region=nac
Q1 = DMN31D5UFZ-7B: MOSFET (N-Channel); Manufacturer_Name: Diodes Incorporated; Datasheet Link: https://www.diodes.com//assets/Datasheets/DMN31D5UFZ.pdf; Manufacturer_Part_Number: DMN31D5UFZ-7B; Mouser Part Number: 621-DMN31D5UFZ-7B; Mouser Price/Stock: https://www.mouser.co.uk/ProductDetail/Diodes-Incorporated/DMN31D5UFZ-7B?qs=IvkZ4pJZlB3BAtMzN9vISA%3D%3D
R1 R3 R4 R7-R10 R12-R14 R16 R20-R22 R24-R27 R29 = ERA1AEB103C: Resistor 10k; Manufacturer_Name: Panasonic; Datasheet Link: http://industrial.panasonic.com/cdbs/www-data/pdf/RDM0000/AOA0000C307.pdf; Height: 0.26mm; Manufacturer_Part_Number: ERA1AEB103C
R2 = RC0201FR-071K8L: Resistor 1.8k; Manufacturer_Name: Yageo Group; Datasheet Link: http://www.yageo.com/documents/recent/PYu-RC0201_51_RoHS_L_8.pdf; Height: 0.26mm; Manufacturer_Part_Number: RC0201FR-071K8L; Mouser Part Number: 603-RC0201FR-071K8L; Mouser Price/Stock: https://www.mouser.com/Search/Refine.aspx?Keyword=603-RC0201FR-071K8L; Arrow Part Number: RC0201FR-071K8L; Arrow Price/Stock: https://www.arrow.com/en/products/rc0201fr-071k8l/yageo?region=nac
R5 R11 R15 R19 = ERA-1AEB101C: Resistor 1M; Manufacturer_Name: Panasonic; Datasheet Link: http://industrial.panasonic.com/cdbs/www-data/pdf/RDM0000/AOA0000C307.pdf; Height: 0.26mm; Manufacturer_Part_Number: ERA-1AEB101C; Mouser Part Number: 667-ERA-1AEB101C; Mouser Price/Stock: https://www.mouser.co.uk/ProductDetail/Panasonic/ERA-1AEB101C?qs=6%252Bc%252B2ke79U4NC8Nf%252Bq1i6A%3D%3D; Arrow Part Number: ERA-1AEB101C; Arrow Price/Stock: https://www.arrow.com/en/products/era-1aeb101c/panasonic?region=nac
R6 = R0201-1k0: Resistor 1.8k; Manufacturer: N.A.; Part number IPS: 00000005786; Part number NEMS: 100100043; Component Status: Active; Pad Count: 2; Value: 1k; Note: Chip Res 1%; Part Number: R0201-1k0; PartId: 100100043; Component Class: Resistors; Author: rsk; Manufacturer Part Number: N.A.; ComponentLink1URL: N.A.; ComponentLink1Description: Datasheet; ComponentLink2URL: N.A.; ComponentLink2Description: Supplier link; HelpURL: N.A.; LatestRevisionDate: 2014-11-13; Published: 2014-11-13; Supplier 1: N.A.; Supplier Part Number 1: N.A.; Supplier 2: N.A.; Supplier Part Number 2: N.A.; Artikkelnr Noca: N.A.; Part number Norautron: N.A.
R17 R18 = RC0201JR-075K1L: Resistor 5.1k; Manufacturer_Name: Yageo Group; Datasheet Link: http://www.yageo.com/documents/recent/PYu-RC0201_51_RoHS_L_8.pdf; Height: 0.26mm; Manufacturer_Part_Number: RC0201JR-075K1L; Mouser Part Number: 603-RC0201JR-075K1L; Mouser Price/Stock: https://www.mouser.com/Search/Refine.aspx?Keyword=603-RC0201JR-075K1L
R23 = RC0201JR-07680RL: Resistor 680 ohms; Manufacturer_Name: Yageo Group; Datasheet Link: http://www.yageo.com/documents/recent/PYu-RC0201_51_RoHS_L_8.pdf; Height: 0.26mm; Manufacturer_Part_Number: RC0201JR-07680RL; Arrow Part Number: RC0201JR-07680RL; Arrow Price/Stock: https://www.arrow.com/en/products/rc0201jr-07680rl/yageo
R28 = RC0201FR-0773K2L: AC0201FR-0776K8L 76.8k; Manufacturer_Name: Yageo Group; Datasheet Link: http://www.yageo.com/documents/recent/PYu-RC0201_51_RoHS_L_8.pdf; Height: 0.26mm; Manufacturer_Part_Number: RC0201FR-0773K2L; Arrow Part Number: RC0201FR-0773K2L; Arrow Price/Stock: https://www.arrow.com/en/products/rc0201fr-0773k2l/yageo?region=nac
S1 = MK-11C04-G013: Switch; Manufacturer_Name: G-Switch Electronic; Datasheet Link: https://www.dg-switch.com/uploads/soft/200615/%E5%93%81%E8%B5%9EMK-11C04-G013.pdf?fbclid=IwZXh0bgNhZW0CMTEAAR0AJCzNXSbXm6tv7QD29iqmkU7HUOTzQEjSSoqvyCwOAtUnKQu-KuAmiDE_aem_1ELsU2yAje-H6Aq4_4J2tg; Height: 0.9mm; Manufacturer_Part_Number: MK-11C04-G013
U1 = nRF54L15-QFAAC00: Multi-protocol Bluetooth Low Energy, IEEE 802.15.4 and 2.4GHz proprietary Wireless MCU; Manufacturer: Nordic Semiconductor; Part number NEMS: 102000382; Component Status: Active; Pad Count: 49; Note: N.A.; Part Number: nRF54L15-QFAAC00; Component Class: Nordic_Devices; Author: stl1; Manufacturer Part Number: nRF54L15-QFAAC00; ComponentLink1URL: N.A.; ComponentLink1Description: Datasheet; ComponentLink2URL: N.A.; ComponentLink2Description: Supplier link; HelpURL: N.A.; LatestRevisionDate: 2025-01-30; Published: 2025-01-30; Footprint Doc: QFN-48; Value: nRF54L15-QFAA; Supplier 1: Nordic Semiconductor; Supplier Part Number 1: nRF54L15-QFAAC00; Supplier 2: N.A.; Supplier Part Number 2: N.A.; Artikkelnr Noca: N.A.; Part number IPS: N.A.; Part number Norautron: N.A.; PartId: 102000382
U2 = CMP-12175-000006-1: ACCEL 2-16G I2C/SPI 12LGA; Manufacturer: STMicroelectronics; Min Supply Voltage: 1.62V; Operating Supply Current: 0.38-90uA; Sensor Output: I2C,SPI; Accel Resolution: 14bits; Max Supply Voltage: 3.6V; Accel Range: 2/4/8/16g; Height: 0.7mm; Device Class L1: Sensors; RoHS: TRUE; Temperature Range Low: -40°C; Category: IC; Mouser Description: Accelerometer Triple ±2g/±4g/±8g/±16g 1.62V to 3.6V 0.244mg/digit/0.488mg/digit/0.976mg/digit/1.952mg/digit 12-Pin LG...; Digikey Description: ACCEL 2-16G I2C/SPI 12LGA; ComponentLink2URL: https://www.st.com/resource/en/datasheet/lis2dw12.pdf; Automotive: No; Manufacturer Part Number: LIS2DW12TR; Lead Free: Yes; Footprint Url: https://www.st.com/content/ccc/resource/technical/document/technical_note/73/17/9c/16/dd/96/4a/01/CD00134799.pdf/files/CD00134799.pdf/jcr:content/translations/en.CD00134799.pdf; Temperature: -40°C to +85°C; Device Class L3: Accelerometers; Package: LGA12-DM00170568; Temperature Range High: +85°C; Device Class L2: Motion Sensors; Octopart: https://octopart.com/lis2dw12tr-stmicroelectronics-77080925; ComponentLink2Description: Datasheet
U3 = NCP163AMX180TBG: Manufacturer_Name: onsemi; Copyright: Copyright (C) 2025 Ultra Librarian. All rights reserved.; Manufacturer_Part_Number: NCP163AMX180TBG; RefDes: RefDes; Type: Type
Y1 = ECS-320-8-37B2-CTN-TR: Crystal or Oscillator; Manufacturer_Name: ECS; Datasheet Link: https://ecsxtal.com/store/pdf/ECX-1637B2.pdf; Height: 0.5mm; Manufacturer_Part_Number: ECS-320-8-37B2-CTN-TR; Mouser Part Number: 520-320-8-37B2-CTNTR; Mouser Price/Stock: https://www.mouser.co.uk/ProductDetail/ECS/ECS-320-8-37B2-CTN-TR?qs=aP1CjGhiNiHdeKDzQVYpfg%3D%3D